# EAGLE design Motor_Driver_ClearanceIssues (EAGLE 7.2.0)
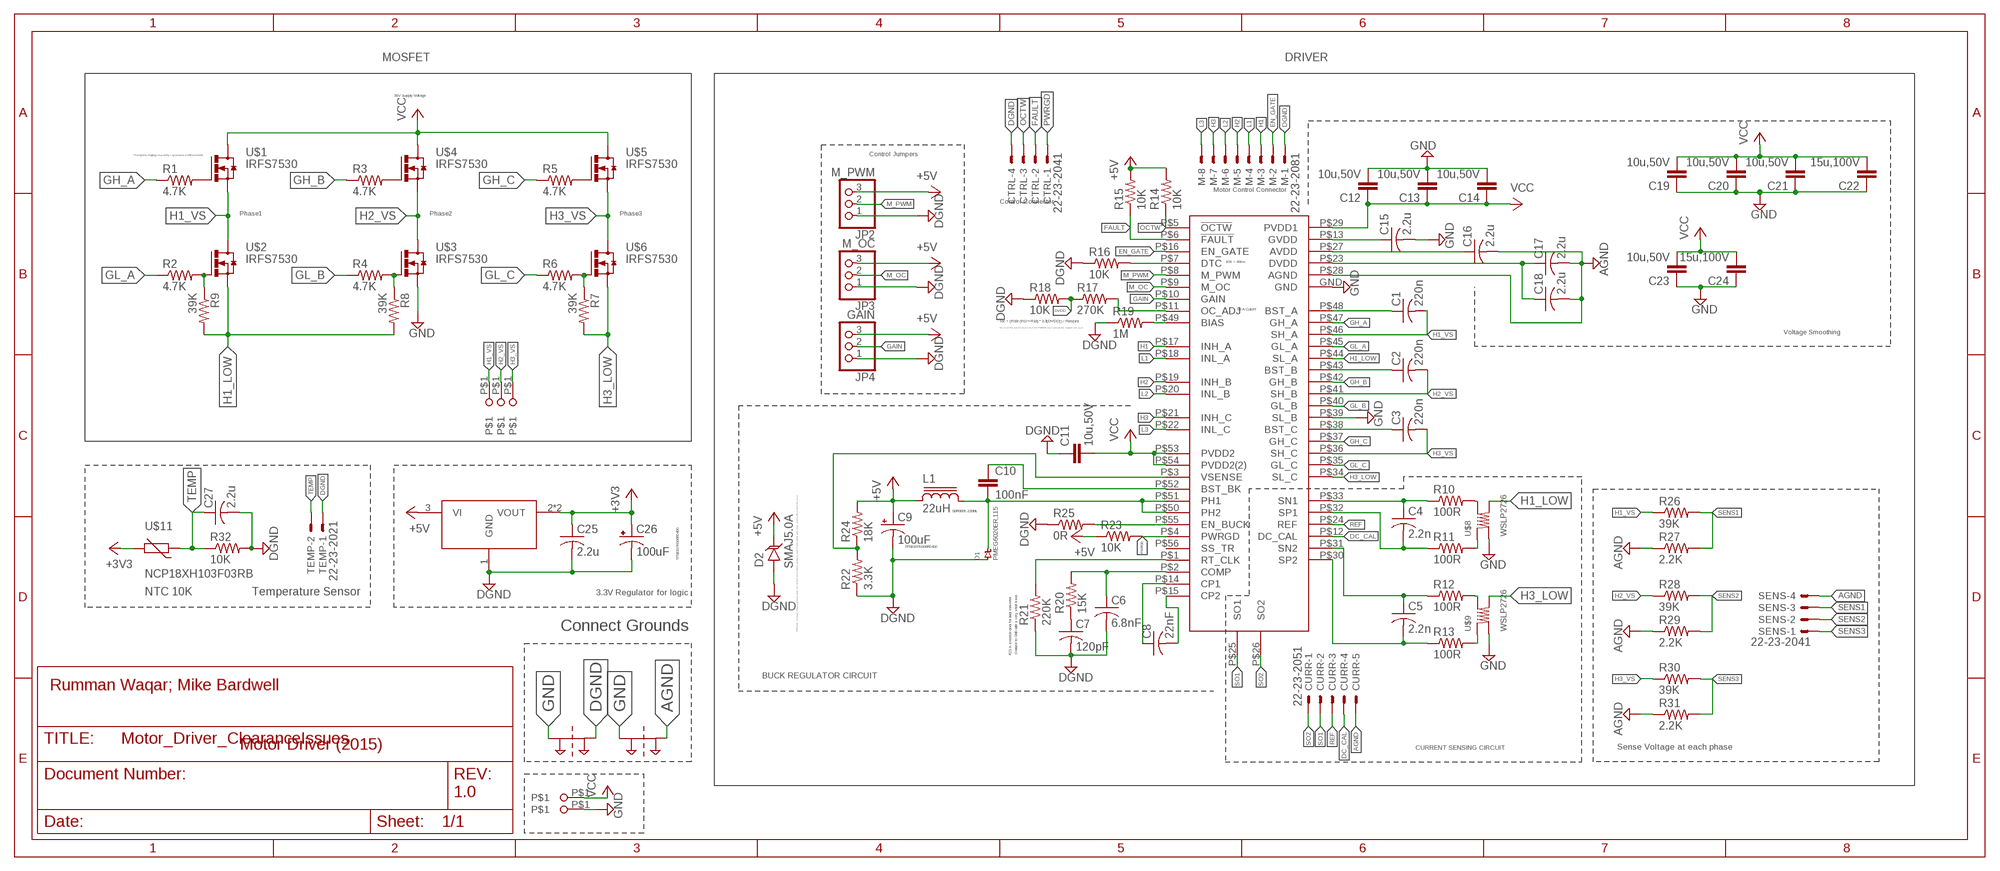
[diagram p0: schematic, sheet 1]

## Parts
C1  220n  C-USC0805  [C0805]
C2  220n  C-USC0805  [C0805]
C3  220n  C-USC0805  [C0805]
C4  2.2n  C-USC0603  [C0603]
C5  2.2n  C-USC0603  [C0603]
C6  6.8nF  C-USC0603  [C0603]
C7  120pF  C-USC0603  [C0603]
C8  22nF  C-USC0603  [C0603]
C9  100uF  CAP_POL3528-KIT  [EIA3528-KIT]
C10  100nF  CAP0805  [0805]
C11  10u,50V  CAP1206  [1206]
C12  10u,50V  CAP1206  [1206]
C13  10u,50V  CAP1206  [1206]
C14  10u,50V  CAP1206  [1206]
C15  2.2u  C-USC0805  [C0805]
C16  2.2u  C-USC0805  [C0805]
C17  2.2u  C-USC0805  [C0805]
C18  2.2u  C-USC0805  [C0805]
C19  10u,50V  CAP1206  [1206]
C20  10u,50V  CAP1206  [1206]
C21  10u,50V  CAP1206  [1206]
C22  15u,100V  C-EUC2220K  [C2220K]
C23  10u,50V  CAP1206  [1206]
C24  15u,100V  C-EUC2220K  [C2220K]
C25  2.2u  C-USC0805  [C0805]
C26  100uF  CAP_POL3528-KIT  [EIA3528-KIT]
C27  2.2u  C-USC0805  [C0805]
CTRL  22-23-2041  [22-23-2041]
CURR  22-23-2051  [22-23-2051]
D1  PMEG6020ER,115  DIODE[SCHOTKY]-SOD123W  [SOD123W]
D2  SMAJ5.0A  TVSSMA  [SMA-DIODE]
JP2  M_PWM  PINHD-1X3  [1X03]
JP3  M_OC  PINHD-1X3  [1X03]
JP4  GAIN  PINHD-1X3  [1X03]
L1  22uH  SDR0805  [SDR0805]
M  22-23-2081  [22-23-2081]
PT1  2PT_GND_TIE  [2PT_GND_TIE]
PT2  2PT_GND_TIE  [2PT_GND_TIE]
R1  4.7K  R-US_R0603  [R0603]
R2  4.7K  R-US_R0603  [R0603]
R3  4.7K  R-US_R0603  [R0603]
R4  4.7K  R-US_R0603  [R0603]
R5  4.7K  R-US_R0603  [R0603]
R6  4.7K  R-US_R0603  [R0603]
R7  39K  R-US_R0603  [R0603]
R8  39K  R-US_R0603  [R0603]
R9  39K  R-US_R0603  [R0603]
R10  100R  R-US_R0603  [R0603]
R11  100R  R-US_R0603  [R0603]
R12  100R  R-US_R0603  [R0603]
R13  100R  R-US_R0603  [R0603]
R14  10K  R-US_R0603  [R0603]
R15  10K  R-US_R0603  [R0603]
R16  10K  R-US_R0603  [R0603]
R17  270K  R-US_R0603  [R0603]
R18  10K  R-US_R0603  [R0603]
R19  1M  R-US_R0603  [R0603]
R20  15K  R-US_R0603  [R0603]
R21  220K  R-US_R0603  [R0603]
R22  3.3K  R-US_R0603  [R0603]
R23  10K  R-US_R0603  [R0603]
R24  18K  R-US_R0603  [R0603]
R25  0R  R-US_R0603  [R0603]
R26  39K  R-US_R0805  [R0805]
R27  2.2K  R-US_R0805  [R0805]
R28  39K  R-US_R0805  [R0805]
R29  2.2K  R-US_R0805  [R0805]
R30  39K  R-US_R0805  [R0805]
R31  2.2K  R-US_R0805  [R0805]
R32  10K  R-US_M0805  [M0805]
SENS  22-23-2041  [22-23-2041]
TEMP  22-23-2021  [22-23-2021]
U$1  IRFS7530  IRFS7530_HEATSINK  [IRF7530_HEATSINK]
U$2  IRFS7530  IRFS7530_HEATSINK  [IRF7530_HEATSINK]
U$3  IRFS7530  IRFS7530_HEATSINK  [IRF7530_HEATSINK]
U$4  IRFS7530  IRFS7530_HEATSINK  [IRF7530_HEATSINK]
U$5  IRFS7530  IRFS7530_HEATSINK  [IRF7530_HEATSINK]
U$6  IRFS7530  IRFS7530_HEATSINK  [IRF7530_HEATSINK]
U$7  DRV8302  [DRV8302]
U$8  WSLP2726  [WSLP2726]
U$9  WSLP2726  [WSLP2726]
U$10  TC2117  [SOT223]
U$11  NCP18XH103F03RB  [R0603]
U$12  1CONN_SOLDER  [1CONN_PAD]
U$13  1CONN_SOLDER  [1CONN_PAD]
U$14  1CONN_SOLDER  [1CONN_PAD]
U$15  1CONN_SOLDER  [1CONN_PAD]
U$16  1CONN_SOLDER  [1CONN_PAD]

## Nets
+3V3: C25.1 C26.A(+) U$10.2(VOUT) U$10.4(VOUT) U$11.2
+5V: C9.A(+) D2.C JP2.3 JP3.3 JP4.3 L1.1 R14.2 R15.2 R23.1 R24.2 U$10.3(VI)
AGND: C16.2 C17.2 C18.2 CURR.5 PT2.P$2 R27.1 R29.1 R31.1 SENS.4 U$7.P$28(AGND)
DC_CAL: CURR.4 U$7.P$12(DC_CAL)
DGND: C6.2 C7.2 C9.C(-) C11.1 C25.2 C26.C(-) C27.2 CTRL.4 D1.P$1 D2.A JP2.1 JP3.1 JP4.1 M.1 PT1.P$2 R16.1 R18.1 R19.1 R21.1 R22.1 R25.1 R32.2 TEMP.1 U$10.1(GND)
DVDD: R17.1 R18.2
EN_GATE: M.2 U$7.P$16(EN_GATE)
FAULT: CTRL.2 R15.1 U$7.P$6(!FAULT)
GAIN: JP4.2 U$7.P$10(GAIN)
GH_A: R1.1 U$7.P$47(GH_A)
GH_B: R3.1 U$7.P$42(GH_B)
GH_C: R5.1 U$7.P$37(GH_C)
GL_A: R2.1 U$7.P$45(GL_A)
GL_B: R4.1 U$7.P$40(GL_B)
GL_C: R6.1 U$7.P$35(GL_C)
GND: C12.2 C13.2 C14.2 C15.2 C19.1 C20.1 C21.1 C22.1 C23.1 C24.1 PT1.P$1 PT2.P$1 U$3.S1(S) U$3.S2(S) U$3.S3(S) U$3.S4(S) U$3.S5(S) U$7.GND U$7.P$39(SL_B) U$8.P$2 U$9.P$2 U$16.P$1
H1: M.3 U$7.P$17(INH_A)
H1_LOW: R8.2 R9.2 U$2.S1(S) U$2.S2(S) U$2.S3(S) U$2.S4(S) U$2.S5(S) U$7.P$44(SL_A) U$8.P$1
H1_VS: C1.2 R26.1 U$1.S1(S) U$1.S2(S) U$1.S3(S) U$1.S4(S) U$1.S5(S) U$2.D1(D) U$7.P$46(SH_A) U$14.P$1
H2: M.5 U$7.P$19(INH_B)
H2_VS: C2.2 R28.1 U$3.D1(D) U$4.S1(S) U$4.S2(S) U$4.S3(S) U$4.S4(S) U$4.S5(S) U$7.P$41(SH_B) U$13.P$1
H3: M.7 U$7.P$21(INH_C)
H3_LOW: R7.2 U$6.S1(S) U$6.S2(S) U$6.S3(S) U$6.S4(S) U$6.S5(S) U$7.P$34(SL_C) U$9.P$1
H3_VS: C3.2 R30.1 U$5.S1(S) U$5.S2(S) U$5.S3(S) U$5.S4(S) U$5.S5(S) U$6.D1(D) U$7.P$36(SH_C) U$12.P$1
L1: M.4 U$7.P$18(INL_A)
L2: M.6 U$7.P$20(INL_B)
L3: M.8 U$7.P$22(INL_C)
M_OC: JP3.2 U$7.P$9(M_OC)
M_PWM: JP2.2 U$7.P$8(M_PWM)
N$1: R1.2 U$1.G1(G)
N$2: R2.2 R9.1 U$2.G1(G)
N$3: R4.2 R8.1 U$3.G1(G)
N$4: R3.2 U$4.G1(G)
N$5: R5.2 U$5.G1(G)
N$6: R6.2 R7.1 U$6.G1(G)
N$7: C1.1 U$7.P$48(BST_A)
N$8: R17.2 U$7.P$11(OC_ADJ)
N$10: C8.1 U$7.P$14(CP1)
N$11: C5.2 R13.1 U$7.P$30(SP2)
N$12: C2.1 U$7.P$43(BST_B)
N$13: C8.2 U$7.P$15(CP2)
N$14: C7.1 R20.1
N$15: R21.2 U$7.P$1(RT_CLK)
N$16: R16.2 U$7.P$7(DTC)
N$17: R25.2 U$7.P$55(EN_BUCK)
N$18: C15.1 U$7.P$13(GVDD)
N$19: C10.2 D1.P$2 L1.2 U$7.P$50(PH2) U$7.P$51(PH1)
N$20: C6.1 R20.2 U$7.P$2(COMP)
N$21: R19.2 U$7.P$49(BIAS)
N$22: C4.1 R10.1 U$7.P$33(SN1)
N$23: C4.2 R11.1 U$7.P$32(SP1)
N$24: C5.1 R12.1 U$7.P$31(SN2)
N$26: C3.1 U$7.P$38(BST_C)
N$27: C16.1 U$7.P$27(AVDD)
N$28: R22.2 R24.1 U$7.P$3(VSENSE)
N$29: C10.1 U$7.P$52(BST_BK)
N$30: C17.1 C18.1 U$7.P$23(DVDD)
N$124: R12.2 U$9.P$3
N$126: R10.2 U$8.P$3
N$127: R11.2 U$8.P$4
N$128: R13.2 U$9.P$4
OCTW: CTRL.3 R14.1 U$7.P$5(!OCTW)
PWRGD: CTRL.1 R23.2 U$7.P$4(PWRGD)
REF: CURR.3 U$7.P$24(REF)
SENS1: R26.2 R27.2 SENS.3
SENS2: R28.2 R29.2 SENS.2
SENS3: R30.2 R31.2 SENS.1
SO1: CURR.2 U$7.P$25(SO1)
SO2: CURR.1 U$7.P$26(SO2)
TEMP: C27.1 R32.1 TEMP.2 U$11.1
VCC: C11.2 C12.1 C13.1 C14.1 C19.2 C20.2 C21.2 C22.2 C23.2 C24.2 U$1.D1(D) U$4.D1(D) U$5.D1(D) U$7.P$29(PVDD1) U$7.P$53(PVDD2) U$7.P$54(PVDD2(2)) U$15.P$1
Unconnected: U$7.P$56(SS_TR)

## Notes on the sheet
- MOSFET | DRIVER
- 36V Supply Voltage
- * Dampens ringing caused by capacitance of the mosfet | Control Jumpers
- Motor Control Connector
- Control Connector
- Phase1 | Phase2 | Phase3
- 10K = 80ns
- 90 A Cutoff
- Ioc = (R18/ (R17+R18) * 3.3[DVDD] ) / Rds(on)
- Don't mount R18, because internal current limit of DRV8302 doesn't work with this config for some reason
- Voltage Smoothing
- SDR0805-220ML
- TPSB107K006R0400
- TPSB107K006R0400
- NTC 10K | Temperature Sensor | 3.3V Regulator for logic
- Connect Grounds | A TVS diode, or transient voltage suppression diode, is an electrical device which is designed to divert or shunt voltage spikes from a circuit in order to protect that circuit.
- R21 is external clock for buck converter. | Connect to GND with a very short trace.
- BUCK REGULATOR CIRCUIT
- Rumman Waqar; Mike Bardwell
- Motor Driver (2015) | CURRENT SENSING CIRCUIT | Sense Voltage at each phase
- 1.0

## Library data of the parts
C1-C8 C15-C18 C25 C27 = adafruit:C-US: CAPACITOR, American symbol
C9 C26 = SparkFun-Capacitors:CAP_POL: Capacitor Polarized These are standard SMD and PTH capacitors. Normally 10uF, 47uF, and 100uF in electrolytic and tantalum varieties. Always verify the external diameter of the through hole cap, it varies with capacity, voltage, and manufacturer. The EIA devices should be standard.
C10-C14 C19-C21 C23 = SparkFun-Passives:CAP: Capacitor Standard 0603 ceramic capacitor, and 0.1" leaded capacitor.
C22 C24 = resistor:C-EU: CAPACITOR, European symbol
CTRL SENS = con-molex:22-23-2041: .100" (2.54mm) Center Header - 4 Pin; MF: MOLEX; MPN: 22-23-2041; OC_FARNELL: 1462920; OC_NEWARK: 38C0355
CURR = con-molex:22-23-2051: .100" (2.54mm) Center Header - 5 Pin; MF: MOLEX; MPN: 22-23-2051; OC_FARNELL: 1462952; OC_NEWARK: 38C9178
D1 = nxp:DIODE[SCHOTKY]
D2 = SparkFun-DiscreteSemi:TVS: Transient voltage suppressor- prevents ESD on inputs.
JP2-JP4 = pinhead:PINHD-1X3: PIN HEADER
L1 = bourne:SDR0805: POWER INDUCTOR
M = con-molex:22-23-2081: .100" (2.54mm) Center Header - 8 Pin; MF: MOLEX; MPN: 22-23-2081; OC_FARNELL: 1756826; OC_NEWARK: 01C7592
PT1 PT2 = SparkFun-Passives:2PT_GND_TIE: Package for connecting two ground nets in one place.
R1-R32 = adafruit:R-US_: RESISTOR, American symbol
TEMP = con-molex:22-23-2021: .100" (2.54mm) Center Header - 2 Pin; MF: MOLEX; MPN: 22-23-2021; OC_FARNELL: 1462926; OC_NEWARK: 25C3832
U$1-U$6 = bldc_lib:IRFS7530_HEATSINK: IRFS7530 with Heatsink
U$7 = bldc_lib:DRV8302: DRV8302 3-Phase Brushless Motor Pre-Driver with Dual Current Sense Amps and Buck Converter (PWM Ctrl)
U$8 U$9 = bldc_lib:WSLP2726: WSLP2726 Power Metal Strip® Resistors, Very High Power (to 7 W), Low Value (down to 0.0003 ), Surface Mount
U$10 = bldc_lib:TC2117
U$11 = bldc_lib:NCP18XH103F03RB: NTC Thermistor NTC Thermistors 10K OHM 1%
U$12-U$16 = bldc_lib:1CONN_SOLDER

## Board
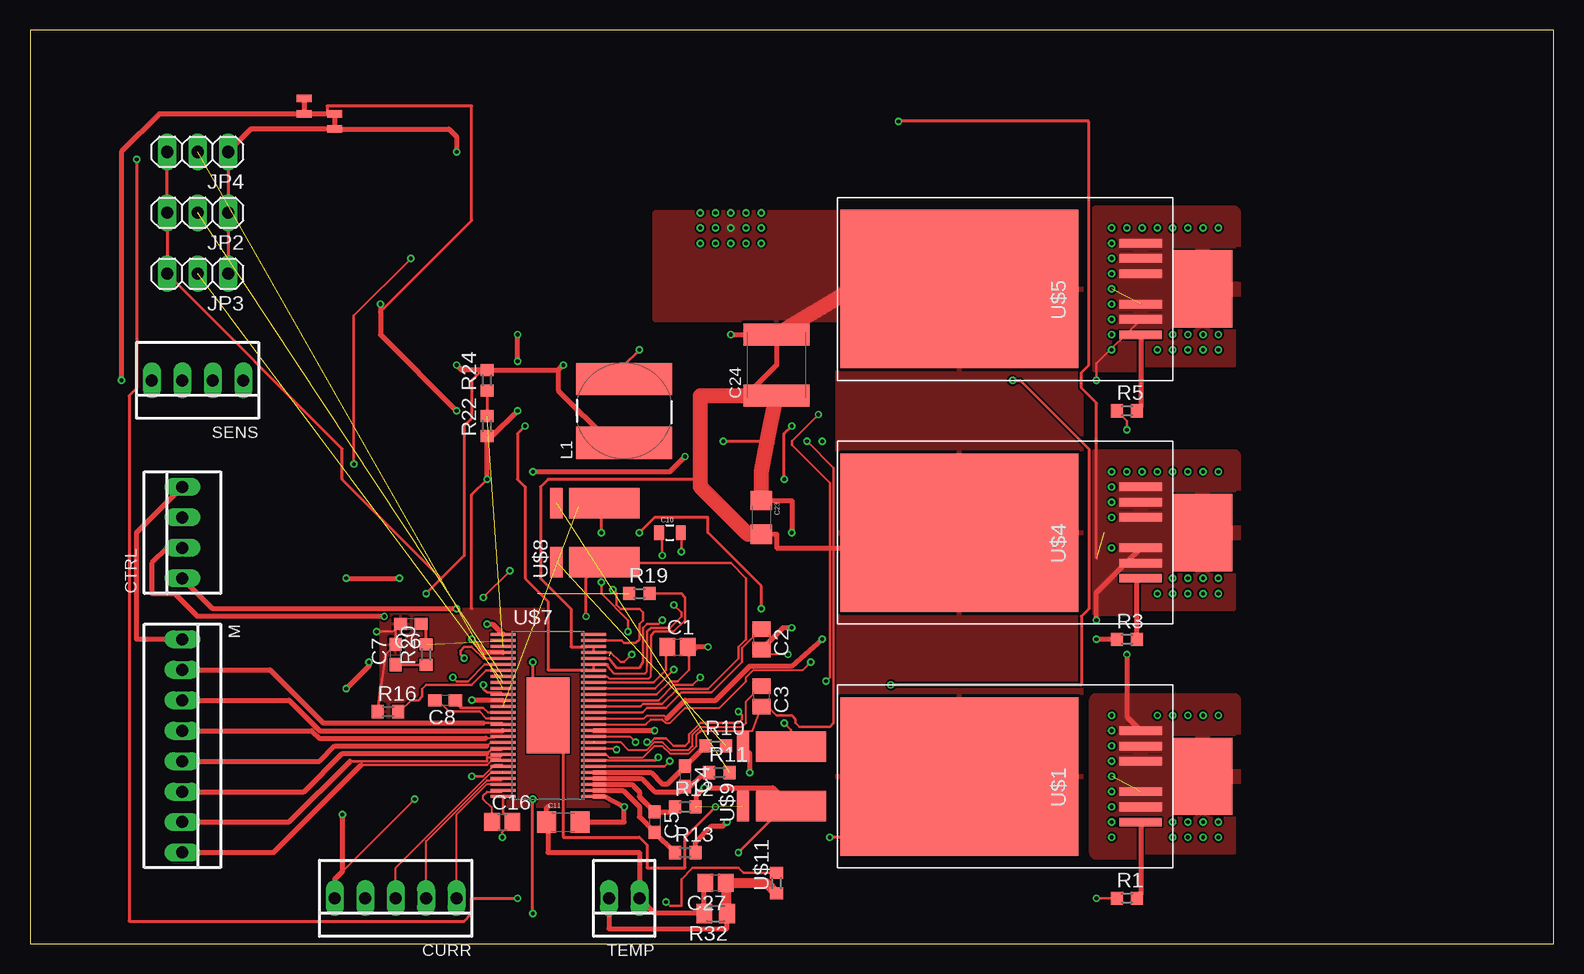
[diagram p1: board, top side]
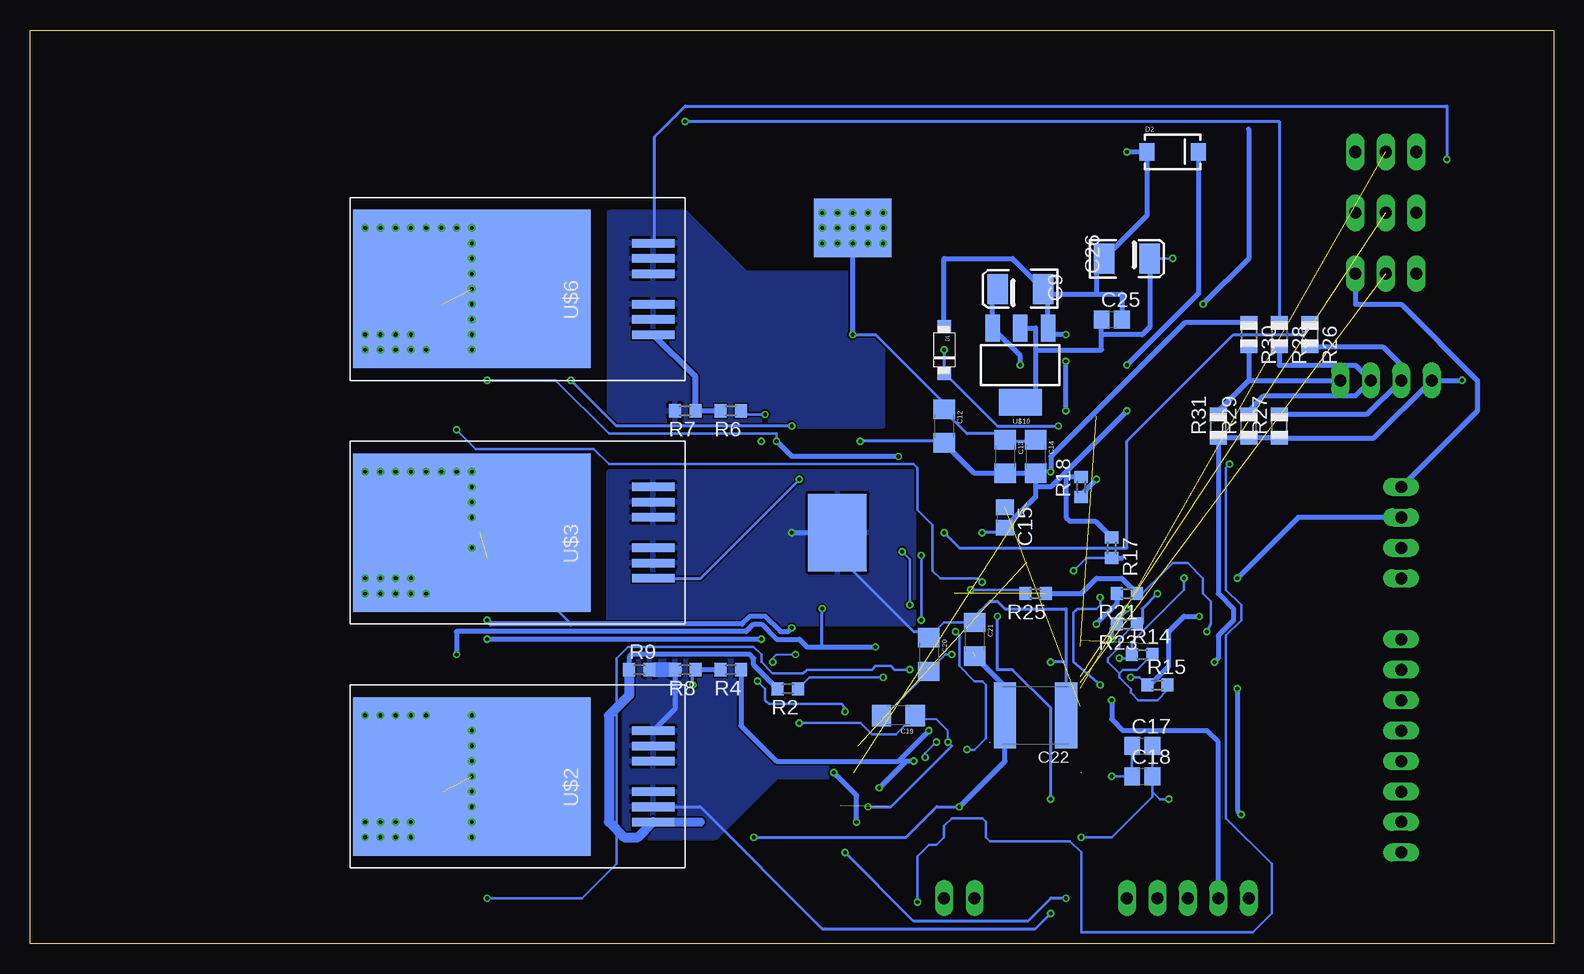
[diagram p2: board, bottom side, seen from below]

Size 127 x 76.2 mm. Coordinates in mm from the lower left corner, seen from the top.
Outline: 0,0 127,0 127,76.2 0,76.2 0,0
Copper layers (1*16): Top 0.203mm / dielectric 1.094mm / Bottom 0.203mm
Design rules "ITEADstudio_DRC *": minimum track width 6mil, minimum drill 12mil, track to track 6mil, track to pad 6mil, pad to pad 6mil, via to via 6mil, smd to smd 0mil, copper to edge 10mil, drill to drill 10mil, minimum pad ring 10mil, minimum via ring 6mil, stop-mask expansion 2mil, vias tented up to drill 100mil, thermal gap 10mil

### Footprints (pad centres in the part's own frame; a part is rotated, then mirrored left to right if it is on the bottom)
C0805 = smd 1.3 x 1.5: 1 -0.85,0; 2 0.85,0
C0603 = smd 1.1 x 1: 1 -0.85,0; 2 0.85,0
EIA3528-KIT = smd 1.7 x 2.5: A 1.9,0; C -1.9,0
0805 = smd 0.8 x 1.2: 1 -0.9,0; 2 0.9,0
1206 = smd 1.6 x 1.8: 1 -1.4,0; 2 1.4,0
C2220K = smd 1.85 x 5.5: 1 -2.55,0; 2 2.55,0
22-23-2041 = drill 1 long: 1 -3.81,0; 2 -1.27,0; 3 1.27,0; 4 3.81,0
22-23-2051 = drill 1 long: 1 -5.08,0; 2 -2.54,0; 3 0,0; 4 2.54,0; 5 5.08,0
SOD123W = smd 1.1 x 1.1: P$1 -1.95,0; P$2 1.95,0
SMA-DIODE = smd 1.27 x 1.47: A -2.15,0; C 2.15,0
1X03 = drill 1.016 long: 1 -2.54,0; 2 0,0; 3 2.54,0
SDR0805 = smd 2.7 x 8: 1 -2.65,0; 2 2.65,0
22-23-2081 = drill 1 long: 1 -8.89,0; 2 -6.35,0; 3 -3.81,0; 4 -1.27,0; 5 1.27,0; 6 3.81,0; 7 6.35,0; 8 8.89,0
2PT_GND_TIE = smd 1.27 x 0.635: P$1 0,0.635; P$2 0,-0.635
R0603 = smd 1 x 1.1: 1 -0.85,0; 2 0.85,0
R0805 = smd 1.1 x 1.4: 1 -1,0; 2 1,0
M0805 = smd 1.3 x 1.6: 1 -0.95,0; 2 0.95,0
22-23-2021 = drill 1 long: 1 -1.27,0; 2 1.27,0
IRF7530_HEATSINK = smd 13.208 x 19.812: D1 0,1.27 | smd 0.711 x 3.556: G1 -3.81,-13.856; S1 -2.54,-13.856; S2 -1.27,-13.856; S3 1.27,-13.856; S4 2.54,-13.856; S5 3.81,-13.856
DRV8302 = smd 3.61 x 6.35: GND 0,0 | smd 2.1 x 0.27: P$1 -3.75,6.75; P$2 -3.75,6.25; P$3 -3.75,5.75; P$4 -3.75,5.25; P$5 -3.75,4.75; P$6 -3.75,4.25; P$7 -3.75,3.75; P$8 -3.75,3.25; P$9 -3.75,2.75; P$10 -3.75,2.25; P$11 -3.75,1.75; P$12 -3.75,1.25; P$13 -3.75,0.75; P$14 -3.75,0.25; P$15 -3.75,-0.25; P$16 -3.75,-0.75; P$17 -3.75,-1.25; P$18 -3.75,-1.75; P$19 -3.75,-2.25; P$20 -3.75,-2.75; P$21 -3.75,-3.25; P$22 -3.75,-3.75; P$23 -3.75,-4.25; P$24 -3.75,-4.75; P$25 -3.75,-5.25; P$26 -3.75,-5.75; P$27 -3.75,-6.25; P$28 -3.75,-6.75; P$29 3.8,-6.75; P$30 3.8,-6.25; P$31 3.8,-5.75; P$32 3.8,-5.25; P$33 3.8,-4.75; P$34 3.8,-4.25; P$35 3.8,-3.75; P$36 3.8,-3.25; P$37 3.8,-2.75; P$38 3.8,-2.25; P$39 3.8,-1.75; P$40 3.8,-1.25; P$41 3.8,-0.75; P$42 3.8,-0.25; P$43 3.8,0.25; P$44 3.8,0.75; P$45 3.8,1.25; P$46 3.8,1.75; P$47 3.8,2.25; P$48 3.8,2.75; P$49 3.8,3.25; P$50 3.8,3.75; P$51 3.8,4.25; P$52 3.8,4.75; P$53 3.8,5.25; P$54 3.8,5.75; P$55 3.8,6.25; P$56 3.8,6.75
WSLP2726 = smd 2.54 x 5.842: P$1 -2.464,-0.889; P$2 2.464,-0.889 | smd 2.54 x 1.016: P$3 -2.464,3.111; P$4 2.464,3.111
SOT223 = smd 1.219 x 2.235: 1 -2.311,-3.099; 2 0,-3.099; 3 2.311,-3.099 | smd 3.6 x 2.2: 4 0,3.099
1CONN_PAD = smd 6.452 x 4.877: P$1 0,0

### Placement (x,y rotation side)
C1  53.98,24.77 0 top
C2  60.96,25.4 270 top
C3  60.96,20.64 270 top
C4  54.61,13.97 270 top
C5  52.07,10.16 270 top
C6  31.75,26.67 180 top
C7  30.48,24.13 90 top
C8  34.61,20.32 180 top
C9  44.45,54.61 180 bottom
C10  53.34,34.29 0 top
C11  44.45,10.16 0 top
C12  50.8,43.18 270 bottom
C13  45.72,40.64 270 bottom
C14  43.18,40.64 270 bottom
C15  45.72,35.56 270 bottom
C16  39.37,10.16 0 top
C17  34.29,16.51 0 bottom
C18  34.29,13.97 0 bottom
C19  54.61,19.05 180 bottom
C20  52.07,24.13 270 bottom
C21  48.26,25.4 270 bottom
C22  43.18,19.05 180 bottom
C23  60.96,35.56 270 top
C24  62.23,48.26 90 top
C25  36.83,52.07 0 bottom
C26  35.56,57.15 0 bottom
C27  57.15,5.08 180 top
CTRL  12.7,34.29 90 top
CURR  30.48,3.81 180 top
D1  50.8,49.53 270 bottom
D2  31.75,66.04 0 bottom
JP2  13.97,60.96 180 top
JP3  13.97,55.88 180 top
JP4  13.97,66.04 180 top
L1  49.53,44.45 90 top
M  12.7,16.51 270 top
PT1  25.4,68.58 0 top
PT2  22.86,69.85 0 top
R1  91.44,3.81 0 top
R2  63.82,21.27 180 bottom
R3  91.44,25.4 0 top
R4  68.58,22.86 180 bottom
R5  91.44,44.45 0 top
R6  68.58,44.45 180 bottom
R7  72.39,44.45 180 bottom
R8  72.39,22.86 180 bottom
R9  76.2,22.86 0 bottom
R10  57.15,16.51 0 top
R11  57.47,14.29 0 top
R12  54.61,11.43 0 top
R13  54.61,7.62 0 top
R14  34.29,24.13 0 bottom
R15  33.02,21.59 0 bottom
R16  29.84,19.37 0 top
R17  36.83,33.02 270 bottom
R18  39.37,38.1 90 bottom
R19  50.8,29.21 0 top
R20  33.02,24.13 90 top
R21  35.56,29.21 180 bottom
R22  38.1,43.18 90 top
R23  35.56,26.67 180 bottom
R24  38.1,46.99 90 top
R25  43.18,29.21 180 bottom
R26  20.32,50.8 270 bottom
R27  22.86,43.18 90 bottom
R28  22.86,50.8 270 bottom
R29  25.4,43.18 90 bottom
R30  25.4,50.8 270 bottom
R31  27.94,43.18 90 bottom
R32  57.15,2.54 180 top
SENS  13.97,46.99 180 top
TEMP  49.53,3.81 180 top
U$1  78.74,13.97 90 top
U$2  88.9,13.97 90 bottom
U$3  88.9,34.29 90 bottom
U$4  78.74,34.29 90 top
U$5  78.74,54.61 90 top
U$6  88.9,54.61 90 bottom
U$7  43.18,19.05 0 top
U$8  46.99,34.29 90 top
U$9  62.55,13.97 90 top
U$10  44.45,48.26 180 bottom
U$11  62.23,5.08 90 top
U$12  97.79,54.61 90 top
U$13  97.79,34.29 90 top
U$14  97.79,13.97 90 top
U$15  58.42,59.69 0 bottom
U$16  59.69,34.29 270 bottom

### Tracks (layer width: path | path; a pad name or v marks a point on that pad's centre or on a via)
+3V3  (via drill 0.3)
  Top 0.203: U$11.2 59.48,5.93 59.05,6.35 55.24,6.35 54.29,5.4 54.29,3.17 53.34,3.17 v53.02,3.49 | v26.99,40.01 26.99,52.39 v31.75,57.15
  Bottom 0.203: v53.02,3.49 53.02,7.3 52.07,8.26 51.44,8.26 50.8,8.89 50.8,9.84 50.16,10.48 47.62,10.48 47.31,10.16 47.31,8.89 46.99,8.57 40.32,8.57 39.37,7.62 39.37,0.95 25.08,0.95 23.5,2.54 23.5,6.67 27.3,10.48 27.3,25.72 26.04,26.99 26.04,28.26 27.3,29.53 27.3,39.69 v26.99,40.01 | v31.75,57.15 C26.A
  Bottom 0.406: U$10.2 43.18,51.36 43.18,49.53 | 43.18,49.53 37.68,49.53 C25.1 37.68,50.8 34.29,50.8 33.66,51.43 C26.A | 43.74,44.45 44.09,44.81 | 44.09,44.81 U$10.4 | 43.18,49.53 43.18,45.72 44.09,44.81
+5V  (via drill 0.3)
  Top 0.254: JP4.3 JP2.3 JP3.3 26.04,41.27 26.04,38.73 34.29,30.48 | 34.29,30.48 36.2,32.38 36.2,43.18 36.83,43.81 36.83,46.99 38.1,48.26 R24.2 | 34.29,30.48 v33.02,29.21
  Top 0.406: v35.56,48.26 35.98,47.84 R24.2 44.03,47.84 | 44.03,47.84 v44.45,48.26 | 44.03,47.84 44.03,46.14 48.26,41.91 49.42,41.91 L1.1
  Bottom 0.203: R15.2 32.17,21.17 33.02,20.32 34.61,20.32 35.24,20.95 35.24,21.27 36.2,22.23 36.2,22.54 | 36.2,22.54 35.88,22.86 34.71,22.86 R14.2 | R23.1 34.92,26.67 36.2,25.4 36.2,24.77 37.15,23.81 37.15,23.5 36.2,22.54
  Bottom 0.254: v33.02,29.21 34.29,27.94 34.29,26.67 R23.1
  Bottom 0.406: C9.A 46.76,54.2 U$10.3 44.45,49.05 v44.45,48.26 | D2.C 29.6,54.22 v35.56,48.26
AGND  (via drill 0.3)
  Top 0.203: U$7.P$28 39.43,10.95 C16.2 39.37,9.31 v39.37,8.89 | CURR.5 25.4,5.4 v32.07,12.06
  Top 0.406: v7.62,46.99 7.62,66.04 10.79,69.22 PT2.P$2 | v28.26,23.5 28.26,23.18 v26.35,21.27 | v26.04,10.79 26.04,6.03 25.4,5.4
  Bottom 0.203: v39.37,8.89 36.83,8.89 33.44,12.28 33.44,12.7 | C17.2 C18.2 33.44,12.7 | v32.07,12.06 32.8,12.06 33.44,12.7
  Bottom 0.406: v7.62,46.99 SENS.4 14.97,42.18 R27.1 R29.1 R31.1 27.94,29.21 26.67,27.94 26.67,26.99 27.94,25.72 27.94,23.81 v28.26,23.5 | v26.35,21.27 26.35,11.11 v26.04,10.79
DC_CAL  (via drill 0.3)
  Top 0.406: U$7.P$12 36.85,20.3 v36.83,20.32
  Bottom 0.406: CURR.4 27.94,16.83 28.89,17.78 35.88,17.78 36.83,18.73 v36.83,20.32
DGND  (via drill 0.3)  (1 unrouted)
  Top 0.203: 29.21,21.59 R16.1 29.63,24.13 C7.2 30.48,26.25 | v28.89,26.04 30.27,26.04 C6.2
  Top 0.254: JP4.1 JP2.1 JP3.1 | v38.1,38.73 36.83,37.47 36.83,27.94
  Top 0.406: JP4.1 18.41,67.94 PT1.P$2 34.92,67.94 35.56,67.31 v35.56,66.04 | M.1 8.89,25.4 8.89,34.29 CTRL.4 | v38.1,38.73 R22.1 38.52,42.33 v40.64,44.45 | v40.64,48.58 v40.64,50.8 | C27.2 56.2,4.98 R32.2 52.07,2.54 TEMP.1 50.8,7.62 43.18,7.62 43.18,10.16 C11.1 43.05,11.3 43.18,11.43
  Bottom 0.203: R21.1 34.29,29.21 31.75,31.75 30.48,31.75 29.21,30.48 29.21,29.21 28.57,28.57 28.57,26.67 v28.89,26.04
  Bottom 0.406: 42.14,54.2 U$10.1 41.58,50.8 v40.64,50.8 | 42.14,54.2 C9.C 45.09,57.15 50.8,57.15 D1.P$1 | 42.14,54.2 38.1,54.2 | 38.1,54.2 35.98,54.2 C25.2 | 38.1,54.2 38.1,57.15 C26.C 33.9,60.71 D2.A v35.56,66.04 | JP3.1 16.51,53.34 12.7,53.34 6.35,46.99 6.35,44.45 CTRL.4 | R18.1 39.37,37.47 v38.1,38.73 | R25.1 39.37,29.21 38.1,30.48 35.98,30.48 R21.1 | v40.64,44.45 v40.64,48.58
  pour Top: 29.21,27.94 48.26,27.94 48.26,11.43 29.21,11.43
DVDD
  Bottom 0.406: R18.2 40.42,38.95 40.64,38.73 40.64,35.56 40.32,35.24 38.2,35.24 R17.1
EN_GATE
  Top 0.203: 37.78,18.41 39.31,18.41 U$7.P$16
  Top 0.406: M.2 20,22.86 24.45,18.41 37.78,18.41
FAULT  (via drill 0.3)
  Top 0.203: U$7.P$6 37.91,23.3 36.51,21.91 35.56,21.91 v35.24,22.23
  Top 0.406: CTRL.2 11.43,33.02 10.16,31.75 10.16,29.21 12.06,29.21 13.97,27.3 v29.53,27.3
  Bottom 0.203: v35.24,22.23 34.51,22.23 R15.1
  Bottom 0.406: R15.1 33.66,21.59 32.07,23.18 32.07,26.04 30.8,27.3 v29.53,27.3
GAIN  (1 unrouted)
GH_A  (via drill 0.3)
  Top 0.203: U$7.P$47 52.1,21.3 v53.66,22.86 | v88.9,3.81 R1.1
  Bottom 0.203: v53.66,22.86 54.93,22.86 55.24,23.18 56.52,23.18 56.83,22.86 62.23,22.86 62.55,22.54 65.09,22.54 66.04,23.5 66.04,24.13 66.67,24.77 77.15,24.77 78.11,23.81 78.11,6.67 80.96,3.81 v88.9,3.81
GH_B  (via drill 0.3)
  Top 0.152: U$7.P$42 51.19,18.8 51.44,19.05 52.84,19.05 53.09,18.8
  Top 0.406: R3.1 v88.9,25.4 | 53.09,18.8 54.61,20.32 57.15,20.32 60.01,23.18 63.5,23.18 v66.04,25.4
  Bottom 0.406: v66.04,25.4 v88.9,25.4
GH_C  (via drill 0.3)
  Top 0.152: U$7.P$37 48.79,16.3 v48.9,16.19
  Top 0.203: v49.85,26.04 49.85,26.99 47.62,29.21 v47.62,30.16 | 90.81,44.23 R5.1 91.44,43.6 v91.44,42.86
  Bottom 0.203: v48.9,16.19 48.26,16.19 47.31,17.14 47.31,21.59 47.62,21.91 48.26,21.91 49.53,23.18 49.53,25.72 v49.85,26.04 | v47.62,30.16 47.94,30.48 51.12,30.48 51.75,31.11 51.75,34.92 53.02,36.2 53.02,39.69 53.34,40.01 78.74,40.01 80.01,41.27 89.85,41.27 v91.44,42.86
GL_A  (via drill 0.3)
  Top 0.203: U$7.P$45 47,20.32 52.39,20.32 53.66,21.59 55.24,21.59 v55.88,22.23
  Bottom 0.203: v55.88,22.23 62.02,22.23 R2.1
GL_B  (via drill 0.3)
  Top 0.406: 46.98,17.78 U$7.P$40 47,17.78 v52.07,17.78
  Bottom 0.406: R4.1 67.73,18.2 64.77,15.24 54.61,15.24 v52.07,17.78
GL_C  (via drill 0.3)
  Top 0.203: U$7.P$35 52.13,15.3 v52.39,15.56 | v51.44,16.83 51.75,16.83 52.07,17.14 53.02,17.14 53.66,16.51 54.61,16.51 54.93,16.83 54.93,17.46 55.88,18.41 59.05,18.41 59.37,18.73 59.37,19.05 v59.05,19.37 | v66.36,21.91 66.67,22.23 66.67,38.42 63.5,41.59 63.5,41.91 v65.72,44.13
  Bottom 0.203: v52.39,15.56 52.39,15.88 v51.44,16.83 | v59.05,19.37 59.05,19.68 59.37,20 65.41,20 65.72,20.32 65.72,21.27 v66.36,21.91 | v65.72,44.13 67.41,44.13 R6.1
GND  (via drill 0.3)
  Top 0.152: U$7.P$39 50.01,17.3 v50.48,16.83
  Top 0.203: U$9.P$2 63.44,17.84 v62.87,18.41
  Top 0.254: v41.91,23.5 41.91,20.32 U$7.GND 44.45,17.78 44.45,8.89 50.8,8.89 51.44,8.26 51.44,6.35 54.61,6.35 54.61,8.89 v57.15,11.43 | 24.77,69.22 24.77,69.85 36.83,69.85 36.83,60.33 29.21,52.7 | v47.62,34.29 47.62,36.2 U$8.P$2 | v57.78,41.91 60.96,41.91 61.45,41.81
  Top 0.406: 22.86,69.22 24.77,69.22 PT1.P$1 25.4,68.58 | v29.21,53.34 29.21,52.7 29.21,50.8 v35.56,44.45 | C23.1 63.5,36.96 v63.5,34.29
  Top 1.27: C23.1 60.96,39.36 61.45,41.81 C24.1
  Bottom 0.152: v50.48,16.83 50.48,17.78 51.44,18.73 52.89,18.73 C19.1
  Bottom 0.203: C21.1 50.8,26.8 C20.1 | v62.87,18.41 57.78,18.41 56.83,17.46 54.8,17.46 C19.1
  Bottom 0.254: 61.59,34.29 53.34,26.04 52.07,26.04 C20.1 | 40.64,23.5 40.64,27.94 45.72,27.94 46.35,28.57 46.99,28.57 48.26,27.3 C21.1 | 40.64,23.5 C22.1 | 40.64,23.5 v41.91,23.5 | v57.15,11.43 55.24,11.43 50.16,16.51 v50.48,16.83 | v47.62,34.29 45.72,34.29 C15.2 | v57.78,41.91 50.8,41.91 C12.2
  Bottom 0.406: C12.2 48.26,39.24 C13.2 C14.2 43.18,38.1 | 43.18,38.1 43.18,37.25 C15.2 | 25.4,67.94 25.4,57.15 v29.21,53.34 | v35.56,44.45 41.91,38.1 43.18,38.1 | v63.5,34.29 61.59,34.29 U$16.P$1
  pour Bottom: 78.74,39.37 53.34,39.37 53.34,26.67 78.74,26.67
H1
  Top 0.254: 39.37,17.78 U$7.P$17
  Top 0.406: M.3 21.59,20.32 24.13,17.78 39.37,17.78 39.41,17.78
H1_LOW  (via drill 0.3)
  Top 0.203: U$7.P$44 50.91,19.8 51.12,20 52.7,20 53.98,21.27 56.52,21.27 59.05,23.81 59.05,24.77 59.69,25.4 59.69,30.48 58.42,31.75 48.26,31.75 47.95,31.75
  Top 0.254: 48.26,31.75 U$8.P$1 47.62,31.75 46.35,30.48 v46.35,27.3 | v41.91,2.54 v41.91,12.06
  Bottom 0.254: v46.35,27.3 46.35,22.86 45.09,22.86 41.91,19.68 v41.91,12.06 | v41.91,2.54 43.18,1.27 60.96,1.27 71.12,11.43 U$2.S1
  Bottom 0.406: R8.2 73.24,19.58 U$2.S5
  Bottom 1.27: R8.2 74.93,22.86
  pour Bottom: 53.34,24.13 77.47,24.13 77.47,8.89 69.85,8.89 64.77,13.97 53.34,13.97
H1_VS  (via drill 0.3)  (1 unrouted)
  Top 0.203: U$7.P$46 52.23,20.8 53.34,21.91 53.98,21.91 54.93,22.86 54.93,24.13 54.93,24.66 C1.2
  Top 0.254: v50.8,34.29 52.07,35.56 56.52,35.56 56.52,34.29 60.96,29.84 v60.96,27.94
  Top 0.406: v56.52,24.77 55.56,24.77 54.93,24.13 | v91.44,24.13 91.44,18.94 U$1.S5
  Bottom 0.254: v50.8,34.29 49.53,33.02 35.56,33.02 35.56,41.91 26.67,50.8 20.95,50.8 20.32,51.44 R26.1 | 60.96,24.77 v60.96,27.94
  Bottom 0.406: v56.52,24.77 60.96,24.77 62.23,24.77 62.87,25.4 64.77,25.4 66.04,26.67 66.67,26.67 67.31,26.04 91.44,26.04 v91.44,24.13
  pour Top: 88.9,20.32 100.33,20.32 100.33,7.62 88.9,7.62
H2
  Top 0.203: 38.1,16.51 38.42,16.83 39.4,16.83 U$7.P$19
  Top 0.406: M.5 24.13,15.24 25.4,16.51 38.1,16.51
H2_VS  (via drill 0.3)  (1 unrouted)
  Top 0.152: U$7.P$41 51.32,18.3 51.75,18.73 52.7,18.73 53.02,18.41 53.34,18.41 54.61,19.68 57.47,19.68 59.69,21.91 59.69,22.23 60.33,22.86 64.45,22.86 v65.09,23.5 | 60.86,24.45 C2.2 61.38,24.13 v63.18,24.13
  Top 0.254: v72.39,68.58 88.27,68.58 88.27,48.26 87.63,47.62 87.63,46.35 88.9,45.09 88.9,32.18
  Top 0.406: v63.5,26.35 62.76,26.35 C2.2 | U$4.S2 88.9,29.32 v88.9,26.99
  Bottom 0.152: v65.09,23.5 65.09,23.81 64.77,24.13 v63.18,24.13
  Bottom 0.254: R28.1 22.86,68.58 v72.39,68.58 | U$3.D1 89.53,34.29 81.92,26.67
  Bottom 0.406: v63.5,26.35 63.82,26.04 64.45,26.04 65.72,27.3 66.99,27.3 67.63,26.67 81.92,26.67 88.58,26.67 v88.9,26.99
  pour Top: 88.9,40.64 100.33,40.64 100.33,27.94 88.9,27.94
H3
  Top 0.203: 26.67,15.24 38.1,15.24 38.1,15.56 39.19,15.56 U$7.P$21
  Top 0.406: M.7 21.59,10.16 26.67,15.24
H3_LOW  (via drill 0.3)
  Top 0.203: U$7.P$34 52.9,14.8 v53.34,15.24
  Top 0.254: v59.05,7.62 62.87,11.43 U$9.P$1 | v40.64,3.81 36.83,3.81 36.83,2.54 36.2,1.91 8.26,1.91 8.26,45.72 8.89,46.35 v8.89,65.41
  Top 0.406: 55.56,11.53 55.56,12.38 v56.2,13.02 61.92,13.02 U$9.P$1
  Bottom 0.254: v59.05,7.62 53.34,1.91 43.81,1.91 41.91,3.81 v40.64,3.81 | v8.89,65.41 8.89,69.85 72.39,69.85 74.93,67.31 74.93,58.42 U$6.S5
  Bottom 0.406: v53.34,15.24 53.98,15.24 v56.2,13.02
  pour Bottom: 78.74,43.18 55.88,43.18 55.88,55.88 67.31,55.88 72.39,60.96 78.74,60.96
H3_VS  (via drill 0.3)  (1 unrouted)
  Top 0.152: C3.2 60.22,17.78 55.88,17.78 55.56,17.46 55.56,16.51 54.93,15.88 53.34,15.88 52.7,16.51 52.07,16.51 51.12,15.56 48.26,15.56 48.02,15.8 U$7.P$36
  Top 0.203: v88.9,46.99 88.9,48.37 U$5.S1 | C3.2 61.49,19.79 62.23,19.05 63.5,19.05 63.82,18.73 63.82,18.41 64.14,18.1 66.67,18.1 66.99,18.41 66.99,39.69 v64.77,41.91
  Top 0.406: v41.91,39.37 53.34,39.37 v54.61,40.64
  Bottom 0.203: v64.77,41.91 64.77,42.55 78.74,42.55 83.19,46.99 v88.9,46.99
  Bottom 0.406: R30.1 30.75,51.8 41.91,40.64 v41.91,39.37 | v54.61,40.64 63.5,40.64 v64.77,41.91
  pour Top: 88.9,60.96 100.33,60.96 100.33,48.26 88.9,48.26
L1
  Top 0.203: 38.01,17.14 U$7.P$18
  Top 0.406: M.4 23.5,17.78 24.13,17.14 38.01,17.14
L2
  Top 0.203: 38.1,15.88 38.42,16.19 39.32,16.19 U$7.P$20
  Top 0.406: M.6 22.86,12.7 26.04,15.88 38.1,15.88
L3
  Top 0.203: U$7.P$22 38.48,15.3 38.1,14.92 27.62,14.92
  Top 0.406: M.8 20.32,7.62 27.62,14.92
M_OC  (1 unrouted)
M_PWM  (1 unrouted)
N$1
  Top 0.406: U$1.G1 92.6,4.12 R1.2
N$2
  Bottom 0.406: R2.2 66.67,23.28 66.67,23.81 66.99,24.13 76.83,24.13 77.05,23.91 R9.1
  Bottom 0.762: U$2.G1 71.12,10.16
  Bottom 0.813: R9.1 77.05,20.74 78.74,19.05 78.74,10.16 77.47,8.89 76.31,8.89 U$2.G1
N$3  (via drill 0.3)
  Top 0.254: v71.75,21.59 87.63,21.59 87.63,27.3 88.27,27.94 88.27,41.27 82.55,46.99 v81.92,46.99 | v63.5,43.18 62.87,42.55 v62.87,38.73
  Bottom 0.254: 71.12,22.86 R8.1 71.75,22.86 v71.75,21.59 | v81.92,46.99 78.11,43.18 v63.5,43.18 | v62.87,38.73 71.12,30.48 U$3.G1
  Bottom 0.406: R4.2 71.12,22.86
N$4
  Top 0.406: R3.2 92.29,30.17 U$4.G1
N$5
  Top 0.406: U$5.G1 92.6,44.76 R5.2
N$6
  Bottom 0.254: 71.12,44.45 R7.1
  Bottom 0.406: R6.2 71.12,44.45
  Bottom 0.508: R7.1 71.54,47.3 U$6.G1
N$7
  Top 0.203: U$7.P$48 51.96,21.8 53.02,22.86 53.02,24.66 C1.1
N$8  (via drill 0.3)
  Top 0.203: v37.78,21.59 37.78,21.27 38.1,20.95 39.27,20.95 U$7.P$11 | v40.01,31.11 v37.78,28.89
  Bottom 0.203: 35.98,32.17 38.95,32.17 v40.01,31.11 | v37.78,21.59 40.01,23.5 40.01,27.62 39.69,27.94 38.1,27.94 37.78,28.26 v37.78,28.89
  Bottom 0.406: R17.2 35.98,32.17
N$10
  Top 0.203: U$7.P$14 38.17,19.3 37.78,19.68 35.88,19.68 35.46,20.11 C8.1
N$11
  Top 0.406: R13.1 C5.2 50.8,10.58 50.8,11.43 49.43,12.8 U$7.P$30
N$12
  Top 0.203: U$7.P$43 51.05,19.3 51.44,19.68 53.02,19.68 54.29,20.95 56.83,20.95 59.37,23.5 59.37,24.66 C2.1
N$13
  Top 0.203: U$7.P$15 38.03,18.8 37.47,19.37 34.92,19.37 33.97,20.32 C8.2
N$14
  Top 0.203: C7.1 R20.1
N$15  (via drill 0.3)
  Top 0.406: v38.1,26.67 38.56,26.67 U$7.P$1
  Bottom 0.406: R21.2 36.41,28.36 v38.1,26.67
N$16
  Top 0.203: U$7.P$7 38.04,22.8 36.83,21.59 33.02,21.59 32.7,21.27 32.7,20.64 32.38,20.32 31.75,20.32 30.8,19.37 R16.2
N$17  (via drill 0.3)
  Top 0.203: U$7.P$55 49.31,25.3 49.53,25.08 50.48,25.08 50.8,25.4 50.8,26.67 51.12,26.99 51.12,27.62 50.8,27.94 49.21,27.94 48.9,28.26 48.9,29.21 v48.58,29.53
  Bottom 0.203: v48.58,29.53 44.35,29.53 R25.2
N$18  (1 unrouted)
N$19  (via drill 0.3)
  Top 0.152: 48.14,23.3 48.14,23.14 48.66,22.54 51.28,22.54 51.44,22.7 51.44,23.18
  Top 0.203: U$7.P$50 U$7.P$51 48.14,23.3 | 51.44,23.18 51.44,26.04 51.75,26.35 53.34,26.35 54.29,27.3 54.29,27.62 v53.66,28.26 | v54.29,32.7 54.29,34.24 C10.2
  Top 0.254: v50.8,49.53 49.53,48.26 L1.2 | v41.27,43.18 40.64,42.55 40.64,38.73 41.27,38.1 41.27,30.48 43.18,28.57 43.18,22.86 46.35,22.86 U$7.P$50
  Bottom 0.203: v53.66,28.26 53.66,32.07 v54.29,32.7
  Bottom 0.254: v50.8,49.53 50.8,47.62 | v41.27,43.18 46.35,43.18 50.8,47.62 | 50.8,47.62 D1.P$2
N$20  (1 unrouted)
  Top 0.254: R20.2 33.02,26.67 C6.1
N$21
  Top 0.152: U$7.P$49 48.11,22.3 48.26,22.15 51.59,22.15 51.75,22.3 51.75,22.86
  Top 0.203: 51.75,22.86 51.75,25.72 52.07,26.04 53.66,26.04 54.61,26.99 54.61,28.89 54.29,29.21 R19.2
N$22
  Top 0.406: U$7.P$33 46.99,14.29 51.75,14.29 52.7,13.34 53.12,13.34 C4.1 R10.1
N$23
  Top 0.406: R11.1 55.88,13.97 55.03,13.12 C4.2 54.19,12.7 52.07,12.7 50.97,13.8 U$7.P$32
N$24
  Top 0.406: U$7.P$31 50.2,13.3 50.8,12.7 50.8,12.28 C5.1 53.34,11.01 R12.1
N$25  (via drill 0.3)
  other vias: 55.88,60.96
N$26  (1 unrouted)
  Top 0.152: 47.01,16.83 49.21,16.83 49.85,16.19 51.44,16.19 52.07,16.83 52.7,16.83 53.34,16.19 54.93,16.19 55.24,16.51 55.24,17.46 55.88,18.1 59.37,18.1 59.69,18.41 59.69,20.22 C3.1
N$27
  Top 0.152: C16.1 38.52,11.33 37.78,12.06 37.78,12.38 38.1,12.7 39.33,12.7 U$7.P$27
N$28  (1 unrouted)
  Top 0.254: R24.1 R22.2
N$29  (via drill 0.3)
  Top 0.203: U$7.P$52 48.27,23.8 48.9,23.02 50.8,23.02 51.12,23.5 51.12,26.35 51.44,26.67 52.39,26.67 v52.7,26.99 | v52.7,32.38 52.7,34.02 C10.1
  Bottom 0.203: v52.7,26.99 v52.7,32.38
N$30  (via drill 0.3)
  Top 0.203: U$7.P$23 39.31,14.92 38.73,14.92 37.78,13.97 v36.83,13.97
  Bottom 0.203: C17.1 C18.1 v36.83,13.97
N$31  (via drill 0.3)
  other vias: 57.15,60.96
N$32  (via drill 0.3)
  other vias: 58.42,60.96
N$33  (via drill 0.3)
  other vias: 59.69,58.42
N$34  (via drill 0.3)
  other vias: 60.96,58.42
N$35  (via drill 0.3)
  other vias: 60.96,60.96
N$36  (via drill 0.3)
  other vias: 59.69,60.96
N$37  (via drill 0.3)
  other vias: 57.15,59.69
N$38  (via drill 0.3)
  other vias: 55.88,59.69
N$39  (via drill 0.3)
  other vias: 55.88,58.42
N$40  (via drill 0.3)
  other vias: 57.15,58.42
N$41  (via drill 0.3)
  other vias: 58.42,58.42
N$42  (via drill 0.3)
  other vias: 59.69,59.69
N$43
  pour Top: 88.9,60.96 100.33,60.96 100.33,48.26 88.9,48.26
N$44  (via drill 0.3)
  other vias: 90.17,39.37
N$45  (via drill 0.3)
  other vias: 90.17,10.16
N$46  (via drill 0.3)
  other vias: 90.17,8.89
N$47  (via drill 0.3)
  other vias: 91.44,39.37
N$48  (via drill 0.3)
  other vias: 92.71,39.37
N$49  (via drill 0.3)
  other vias: 93.98,39.37
N$50  (via drill 0.3)
  other vias: 95.25,39.37
N$51  (via drill 0.3)
  other vias: 96.52,39.37
N$52  (via drill 0.3)
  other vias: 97.79,39.37
N$53  (via drill 0.3)
  other vias: 99.06,39.37
N$54  (via drill 0.3)
  other vias: 90.17,38.1
N$55  (via drill 0.3)
  other vias: 90.17,36.83
N$56  (via drill 0.3)
  other vias: 90.17,35.56
N$58  (via drill 0.3)
  other vias: 90.17,33.02
N$60  (via drill 0.3)
  other vias: 60.96,59.69
N$61  (via drill 0.3)
  other vias: 95.25,8.89
N$62  (via drill 0.3)
  other vias: 96.52,8.89
N$63  (via drill 0.3)
  other vias: 97.79,8.89
N$64  (via drill 0.3)
  other vias: 90.17,19.05
N$67  (via drill 0.3)
  other vias: 93.98,19.05
N$68  (via drill 0.3)
  other vias: 95.25,19.05
N$69  (via drill 0.3)
  other vias: 96.52,19.05
N$70  (via drill 0.3)
  other vias: 97.79,19.05
N$71  (via drill 0.3)
  other vias: 99.06,19.05
N$72  (via drill 0.3)
  other vias: 90.17,17.78
N$73  (via drill 0.3)
  other vias: 90.17,16.51
N$74  (via drill 0.3)
  other vias: 90.17,15.24
N$75  (via drill 0.3)
  other vias: 90.17,13.97
N$76  (via drill 0.3)
  other vias: 90.17,12.7
N$77  (via drill 0.3)
  other vias: 90.17,11.43
N$78  (via drill 0.3)
  other vias: 99.06,8.89
N$79  (via drill 0.3)
  other vias: 99.06,10.16
N$80  (via drill 0.3)
  other vias: 97.79,10.16
N$81  (via drill 0.3)
  other vias: 96.52,10.16
N$82  (via drill 0.3)
  other vias: 90.17,59.69
N$83  (via drill 0.3)
  other vias: 91.44,59.69
N$84  (via drill 0.3)
  other vias: 92.71,59.69
N$85  (via drill 0.3)
  other vias: 93.98,59.69
N$86  (via drill 0.3)
  other vias: 95.25,59.69
N$87  (via drill 0.3)
  other vias: 96.52,59.69
N$88  (via drill 0.3)
  other vias: 97.79,59.69
N$89  (via drill 0.3)
  other vias: 99.06,59.69
N$90  (via drill 0.3)
  other vias: 90.17,58.42
N$91  (via drill 0.3)
  other vias: 90.17,57.15
N$92  (via drill 0.3)
  other vias: 90.17,55.88
N$93  (via drill 0.3)
  other vias: 90.17,54.61
N$94  (via drill 0.3)
  other vias: 90.17,53.34
N$95  (via drill 0.3)
  other vias: 90.17,52.07
N$96  (via drill 0.3)
  other vias: 95.25,10.16
N$100  (via drill 0.3)
  other vias: 90.17,50.8
N$101  (via drill 0.3)
  other vias: 90.17,49.53
N$104  (via drill 0.3)
  other vias: 93.98,49.53
N$105  (via drill 0.3)
  other vias: 95.25,49.53
N$106  (via drill 0.3)
  other vias: 96.52,49.53
N$107  (via drill 0.3)
  other vias: 97.79,49.53
N$108  (via drill 0.3)
  other vias: 99.06,49.53
N$109  (via drill 0.3)
  other vias: 93.98,29.21
N$110  (via drill 0.3)
  other vias: 95.25,29.21
N$111  (via drill 0.3)
  other vias: 96.52,29.21
N$112  (via drill 0.3)
  other vias: 97.79,29.21
N$113  (via drill 0.3)
  other vias: 99.06,29.21
N$114  (via drill 0.3)
  other vias: 95.25,30.48
N$115  (via drill 0.3)
  other vias: 96.52,30.48
N$116  (via drill 0.3)
  other vias: 97.79,30.48
N$117  (via drill 0.3)
  other vias: 99.06,30.48
N$118  (via drill 0.3)
  other vias: 95.25,50.8
N$119  (via drill 0.3)
  other vias: 96.52,50.8
N$120  (via drill 0.3)
  other vias: 97.79,50.8
N$121  (via drill 0.3)
  other vias: 99.06,50.8
N$122
  pour Top: 88.9,40.64 100.33,40.64 100.33,27.94 88.9,27.94
N$123  (via drill 0.3)
  other vias: 66.04,41.91
N$124  (1 unrouted)
N$125
  pour Top: 88.9,20.32 100.33,20.32 100.33,7.62 88.9,7.62
N$126  (1 unrouted)
N$127  (1 unrouted)
N$128  (via drill 0.3)
  Top 0.406: R13.2 55.46,8.47 56.83,9.84 57.78,9.84 v58.1,10.16 | v60.01,14.29 60.01,15.86 U$9.P$4
  Bottom 0.406: v58.1,10.16 58.1,12.38 v60.01,14.29
OCTW  (via drill 0.3)
  Top 0.203: U$7.P$5 37.8,23.8 36.83,24.77 36.2,24.77 35.88,24.45 35.88,24.13 v36.2,23.81
  Top 0.406: v26.35,30.48 v30.8,30.48
  Bottom 0.203: v30.8,30.48 30.8,29.53 35.14,25.18 R14.1 35.46,23.81 v36.2,23.81
  Bottom 0.406: CTRL.3 21.27,35.56 v26.35,30.48
PWRGD  (via drill 0.3)
  Top 0.406: U$7.P$4 37.93,24.3 v36.83,25.4 | v35.56,27.94 15.24,27.94 CTRL.1
  Bottom 0.406: v36.83,25.4 36.83,26.25 R23.2 36.41,27.09 v35.56,27.94
REF  (1 unrouted)
  Top 0.152: CURR.3 30.48,6.35 38.42,14.29 39.37,14.29 | U$7.P$24 39.38,14.3
SENS1
  Bottom 0.406: R26.2 14.24,49.8 12.7,48.26 SENS.3 15.51,44.18 R27.2
SENS2
  Bottom 0.406: R28.2 22.86,48.26 16.51,48.26 SENS.2 16.51,45.72 24.13,45.72 25.4,44.45 R29.2
SENS3
  Bottom 0.406: R30.2 25.4,46.99 | 25.4,46.99 SENS.1 | R31.2 27.94,44.45 25.4,46.99
SO1
  Top 0.152: CURR.2 33.02,8.57 38.1,13.65 39.28,13.65 U$7.P$25
SO2
  Top 0.152: CURR.1 35.56,10.79 38.1,13.34 39.4,13.34 U$7.P$26
TEMP
  Top 0.406: 58,2.64 R32.1 58.1,1.27 48.26,1.27 TEMP.2
  Top 0.813: U$11.1 61.38,5.08 C27.1 58,2.64
VCC  (via drill 0.3)  (1 unrouted)
  Top 0.203: v50.16,24.13 49.53,23.5 49.21,23.5 48.41,24.3 U$7.P$53 U$7.P$54
  Top 0.254: 55.88,38.73 43.18,38.73 42.55,38.1 42.55,30.48 45.09,27.94 45.09,24.77 46.35,24.77 U$7.P$54 | v66.67,8.89 77.47,8.89 U$1.D1
  Top 0.406: U$7.P$29 47.86,12.3 v49.53,11.43 49.53,10.16 C11.2 | 59.69,45.72 62.23,48.26 C24.2 v58.42,50.8 | C23.2 62.23,34.16 62.23,33.02 77.47,33.02 U$4.D1
  Top 1.27: U$5.D1 68.57,54.61 C24.2 | C23.2 59.82,34.16 55.88,38.1 55.88,38.73 55.88,45.72 59.69,45.72
  Bottom 0.203: v50.16,24.13 50.67,24.13 C20.2 55.75,19.05 C19.2
  Bottom 0.254: C14.1 43.18,41.91 45.72,41.91 C13.1 45.72,42.55 48.9,42.55 50.8,44.45 C12.1 50.8,45.09 56.52,50.8 v58.42,50.8 | v49.53,11.43 51.44,11.43 53.98,8.89 v66.67,8.89
  Bottom 0.406: v49.53,11.43 45.72,15.24 C22.2 45.73,21.47 C21.2 | U$15.P$1 v58.42,50.8
  other vias: 58.42,59.69
  pour Top: 67.31,7.62 87.63,7.62 87.63,60.96 52.07,60.96 52.07,52.07 67.31,52.07